# EasyEDA schematic G1000_Base.json
TITLE: Sheet_1; REV: 1.0; Date: 2024-03-30; Sheet: 1/1; Drawn By: gagagu1; Company: Your Company
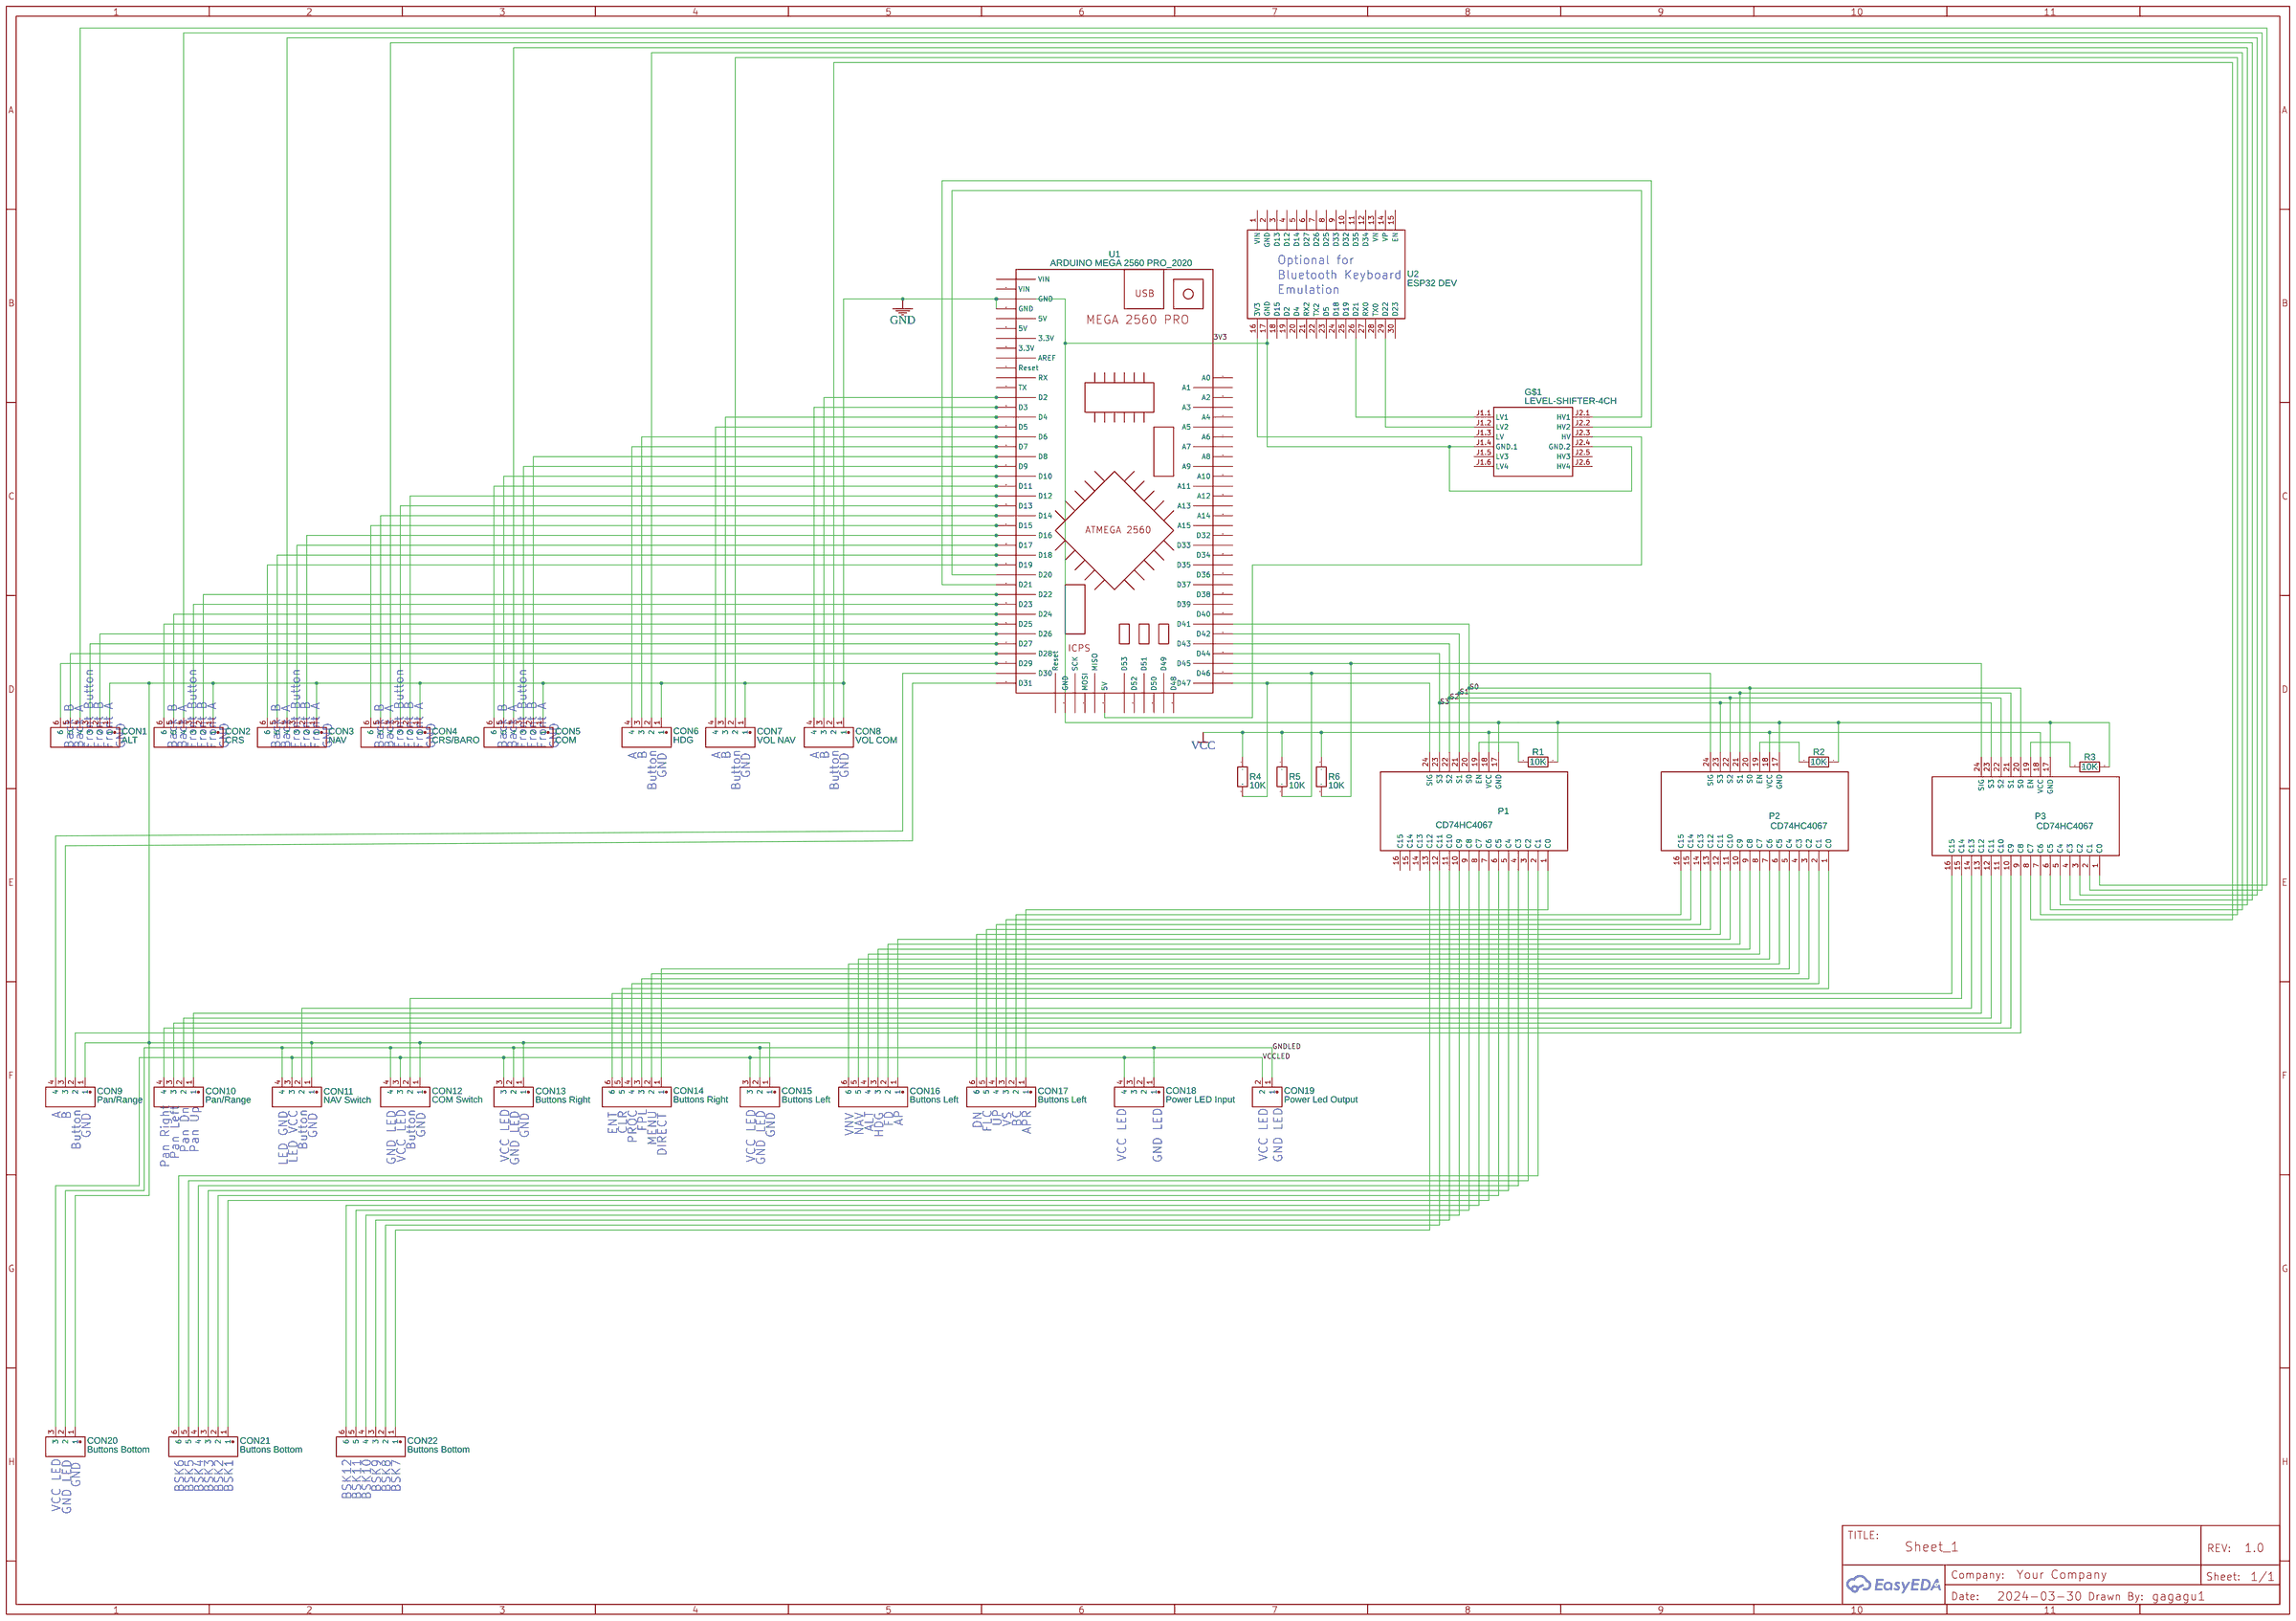
[diagram p0: schematic sheet]

## Parts
CON1  ALT  [ARUN-CONN-TH_XH-6A]
CON2  CRS  [ARUN-CONN-TH_XH-6A]
CON3  NAV  [ARUN-CONN-TH_XH-6A]
CON4  CRS/BARO  [ARUN-CONN-TH_XH-6A]
CON5  COM  [ARUN-CONN-TH_XH-6A]
CON6  HDG  [ARUN-CONN-TH_XH-4A-1]
CON7  VOL NAV  [ARUN-CONN-TH_XH-4A-1]
CON8  VOL COM  [ARUN-CONN-TH_XH-4A-1]
CON9  Pan/Range  [ARUN-CONN-TH_XH-4A-1]
CON10  Pan/Range  [ARUN-CONN-TH_XH-4A-1]
CON11  NAV Switch  [1X4 PIN]
CON12  COM Switch  [1X4 PIN]
CON13  Buttons Right  [CONN-TH_3P-P2.50_HC-XH-3A-G]
CON14  Buttons Right  [ARUN-CONN-TH_XH-6A]
CON15  Buttons Left  [CONN-TH_3P-P2.50_HC-XH-3A-G]
CON16  Buttons Left  [ARUN-CONN-TH_XH-6A]
CON17  Buttons Left  [ARUN-CONN-TH_XH-6A]
CON18  Power LED Input  [ARUN-CONN-TH_XH-4A-1]
CON19  Power Led Output  [CONN-TH_2P-P2.50_HC-XH-2A-G]
CON20  Buttons Bottom  [CONN-TH_3P-P2.50_HC-XH-3A-G]
CON21  Buttons Bottom  [ARUN-CONN-TH_XH-6A]
CON22  Buttons Bottom  [ARUN-CONN-TH_XH-6A]
G$1  LEVEL-SHIFTER-4CH  [LEVEL-SHIFTER-4CH]
P1  CD74HC4067  [CD74HC4067]
P2  CD74HC4067  [CD74HC4067]
P3  CD74HC4067  [CD74HC4067]
R1  10K  [R_AXIAL-0.4]
R2  10K  [R_AXIAL-0.4]
R3  10K  [R_AXIAL-0.4]
R4  10K  [R_AXIAL-0.4]
R5  10K  [R_AXIAL-0.4]
R6  10K  [R_AXIAL-0.4]
U1  ARDUINO MEGA 2560 PRO_2020  [ARDUINO MEGA 2560 PRO]
U2  ESP32 DEV  [ESP32_DEVKIT_MELIFE]

## Library data of the parts
CON1-CON5 CON14 CON16 CON17 CON21 CON22 = ARUN-CONN-TH_XH-6A: Supplier: LCSC; Supplier Part: C722879; Manufacturer: CAX; Manufacturer Part: XH-6A; Contributor: LCSC; JLCPCB Part Class: Extended Part
CON6-CON10 CON18 = ARUN-CONN-TH_XH-4A: Supplier: LCSC; Supplier Part: C192885; Manufacturer: BOOMELE(博穆精密); Manufacturer Part: XH-4A绿色; JLCPCB Part Class: Extended Part; Contributor: LCSC
CON11 CON12 = 1X4PIN: Supplier: LCSC; Supplier Part: C225501; Manufacturer: Changjiang Connectors; Manufacturer Part: A2541HWV-4P; Contributor: LCSC; JLCPCB Part Class: Extended Part
CON13 CON15 CON20 = HC-XH-3A-G: Contributor: Мэтт Милер; Supplier: LCSC; Supplier Part: C5341202; Manufacturer: HCTL(华灿天禄); JLCPCB Part Class: Extended Part
CON19 = HC-XH-2A-G: Supplier: LCSC; Supplier Part: C5341201; Manufacturer: HCTL(华灿天禄); link: https://atta.szlcsc.com/upload/public/pdf/source/20230105/4FFD2EFD3DA44AA828171A44400F3EDE.pdf; Contributor: zafariqbal832159; JLCPCB Part Class: Extended Part
G$1 = LEVEL-SHIFTER-4CH: Contributor: Ex T
P1-P3 = CD74HC4067: sourceId: 1T5FDZYC8; Contributor: andy vu
R1-R6 = R_AXIAL-0.4_EU: Contributor: LCEDA_Lib
U1 = ARDUINO MEGA 2560 PRO_2020: Manufacturer Part: Arduino Mega 2560 Pro Mini; link: https://www.arduino.cc; Contributor: sinivan003
U2 = ESP32 DEV: Manufacturer Part: ESP32; link: https://www.amazon.com/gp/product/B07Q576VWZ/ref=ppx_yo_dt_b_search_asin_title?ie=UTF8&psc=1; Contributor: Alan

## Nets
GND: CON1.1 CON2.1 CON3.1 CON4.1 CON5.1 CON6.1 CON7.1 CON8.1 CON9.1 CON11.1 CON12.1 CON13.1 CON15.1 CON20.1 G$1.J1.4(GND.1) G$1.J2.4(GND.2) P1.17(GND) P2.17(GND) P3.17(GND) R1.1 R2.1 R3.1 U1.43(GND) U1.83(GND) U1.84(GND) U2.17(GND)
GNDLED: CON11.4 CON12.4 CON13.2 CON15.2 CON18.1 CON19.1 CON20.2
VCC: P1.18(VCC) P2.18(VCC) P3.18(VCC) R4.1 R5.1 R6.1
VCCLED: CON11.3 CON12.3 CON13.3 CON15.3 CON18.4 CON19.2 CON20.3
S0: P1.20(S0) P2.20(S0) P3.20(S0) U1.26(D41)
S1: P1.21(S1) P2.21(S1) P3.21(S1) U1.27(D42)
S2: P1.22(S2) P2.22(S2) P3.22(S2) U1.28(D43)
S3: P1.23(S3) P2.23(S3) P3.23(S3) U1.29(D44)
Net-(CON1-2): CON1.2 U1.50(D26)
Net-(CON1-3): CON1.3 U1.49(D27)
Net-(CON1-4): CON1.4 P3.1(C0)
Net-(CON1-5): CON1.5 U1.48(D28)
Net-(CON1-6): CON1.6 U1.47(D29)
Net-(CON2-2): CON2.2 U1.54(D22)
Net-(CON2-3): CON2.3 U1.53(D23)
Net-(CON2-4): CON2.4 P3.2(C1)
Net-(CON2-5): CON2.5 U1.52(D24)
Net-(CON2-6): CON2.6 U1.51(D25)
Net-(CON3-2): CON3.2 U1.60(D16)
Net-(CON3-3): CON3.3 U1.59(D17)
Net-(CON3-4): CON3.4 P3.3(C2)
Net-(CON3-5): CON3.5 U1.58(D18)
Net-(CON3-6): CON3.6 U1.57(D19)
Net-(CON4-2): CON4.2 U1.64(D12)
Net-(CON4-3): CON4.3 U1.63(D13)
Net-(CON4-4): CON4.4 P3.4(C3)
Net-(CON4-5): CON4.5 U1.62(D14)
Net-(CON4-6): CON4.6 U1.61(D15)
Net-(CON5-2): CON5.2 U1.68(D8)
Net-(CON5-3): CON5.3 U1.67(D9)
Net-(CON5-4): CON5.4 P3.5(C4)
Net-(CON5-5): CON5.5 U1.66(D10)
Net-(CON5-6): CON5.6 U1.65(D11)
Net-(CON6-2): CON6.2 P3.6(C5)
Net-(CON6-3): CON6.3 U1.70(D6)
Net-(CON6-4): CON6.4 U1.69(D7)
Net-(CON7-2): CON7.2 P3.7(C6)
Net-(CON7-3): CON7.3 U1.72(D4)
Net-(CON7-4): CON7.4 U1.71(D5)
Net-(CON8-2): CON8.2 P3.8(C7)
Net-(CON8-3): CON8.3 U1.74(D2)
Net-(CON8-4): CON8.4 U1.73(D3)
Net-(CON9-2): CON9.2 P3.9(C8)
Net-(CON9-3): CON9.3 U1.45(D31)
Net-(CON9-4): CON9.4 U1.46(D30)
Net-(CON10-1): CON10.1 P3.13(C12)
Net-(CON10-2): CON10.2 P3.12(C11)
Net-(CON10-3): CON10.3 P3.11(C10)
Net-(CON10-4): CON10.4 P3.10(C9)
Net-(CON11-2): CON11.2 P3.14(C13)
Net-(CON12-2): CON12.2 P3.15(C14)
Net-(CON14-1): CON14.1 P2.5(C4)
Net-(CON14-2): CON14.2 P2.4(C3)
Net-(CON14-3): CON14.3 P2.3(C2)
Net-(CON14-4): CON14.4 P2.2(C1)
Net-(CON14-5): CON14.5 P2.1(C0)
Net-(CON14-6): CON14.6 P3.16(C15)
Net-(CON16-1): CON16.1 P2.11(C10)
Net-(CON16-2): CON16.2 P2.10(C9)
Net-(CON16-3): CON16.3 P2.9(C8)
Net-(CON16-4): CON16.4 P2.8(C7)
Net-(CON16-5): CON16.5 P2.7(C6)
Net-(CON16-6): CON16.6 P2.6(C5)
Net-(CON17-1): CON17.1 P1.1(C0)
Net-(CON17-2): CON17.2 P2.16(C15)
Net-(CON17-3): CON17.3 P2.15(C14)
Net-(CON17-4): CON17.4 P2.14(C13)
Net-(CON17-5): CON17.5 P2.13(C12)
Net-(CON17-6): CON17.6 P2.12(C11)
Net-(CON21-1): CON21.1 P1.7(C6)
Net-(CON21-2): CON21.2 P1.6(C5)
Net-(CON21-3): CON21.3 P1.5(C4)
Net-(CON21-4): CON21.4 P1.4(C3)
Net-(CON21-5): CON21.5 P1.3(C2)
Net-(CON21-6): CON21.6 P1.2(C1)
Net-(CON22-1): CON22.1 P1.13(C12)
Net-(CON22-2): CON22.2 P1.12(C11)
Net-(CON22-3): CON22.3 P1.11(C10)
Net-(CON22-4): CON22.4 P1.10(C9)
Net-(CON22-5): CON22.5 P1.9(C8)
Net-(CON22-6): CON22.6 P1.8(C7)
Net-(G$1-J1.1): G$1.J1.1(LV1) U2.26(D21)
Net-(G$1-J1.2): G$1.J1.2(LV2) U2.29(D22)
Net-(G$1-J1.3): G$1.J1.3(LV) U2.16(3V3)
Net-(G$1-J2.1): G$1.J2.1(HV1) U1.56(D20)
Net-(G$1-J2.2): G$1.J2.2(HV2) U1.55(D21)
Net-(G$1-J2.3): G$1.J2.3(HV) U1.39(5V)
Net-(P1-19): P1.19(EN) R1.2
Net-(P1-24): P1.24(SIG) R4.2 U1.32(D47)
Net-(P2-19): P2.19(EN) R2.2
Net-(P2-24): P2.24(SIG) R5.2 U1.31(D46)
Net-(P3-19): P3.19(EN) R3.2
Net-(P3-24): P3.24(SIG) R6.2 U1.30(D45)

Not connected (* = marked no-connect by the designer): CON18 2 3; G$1 J1.5(LV3) J1.6(LV4) J2.5(HV3) J2.6(HV4); P1 14(C13) 15(C14) 16(C15); U1 1(A0) 2(A1) 3(A2) 4(A3) 5(A4) 6(A5) 7(A6) 8(A7) 9(A8) 10(A9) 11(A10) 12(A11) 13(A12) 14(A13) 15(A14) 16(A15) 17(D32) 18(D33) 19(D34) 20(D35) 21(D36) 22(D37) 23(D38) 24(D39) 25(D40) 33(D48) 34(D49) 35(D50) 36(D51) 37(D52) 38(D53) 40(MISO) 41(MOSI) 42(SCK) 44(Reset) 75(TX) 76(RX) 77(Reset) 78(AREF) 79(3.3V) 80(3.3V) 81(5V) 82(5V) 85(VIN) 86(VIN); U2 1(VIN) 2(GND) 3(D13) 4(D12) 5(D14) 6(D27) 7(D26) 8(D25) 9(D33) 10(D32) 11(D35) 12(D34) 13(VN) 14(VP) 15(EN) 18(D15) 19(D2) 20(D4) 21(RX2) 22(TX2) 23(D5) 24(D18) 25(D19) 27(RX0) 28(TX0) 30(D23)

## Notes on the sheet
- Optional for
- Bluetooth Keyboard
- Emulation
- Back B
- Back A
- Front Button
- Front B
- Front A
- GND
- Back B
- Back A
- Front Button
- Front B
- Front A
- GND
- Back B
- Back A
- Front Button
- Front B
- Front A
- GND
- Back B
- Back A
- Front Button
- Front B
- Front A
- GND
- Back B
- Back A
- Front Button
- Front B
- Front A
- GND
- A
- B
- A
- B
- A
- B
- GND
- GND
- GND
- Button
- Button
- Button
- A
- B
- ENT
- CLR
- FPL
- VNV
- NAV
- ALT
- FD
- AP
- DN
- FLC
- UP
- VS
- BC
- APR
- GND
- GND
- GND
- GND
- PROC
- MENU
- GND
- HDG
- Button
- Pan Left
- Pan Dn
- Pan Up
- Button
- Button
- DIRECT
- Pan Right
- LED GND
- LED VCC
- GND LED
- VCC LED
- VCC LED
- GND LED
- VCC LED
- GND LED
- VCC LED
- GND LED
- VCC LED
- GND LED
- GND
- BSK6
- BSK5
- BSK4
- BSK3
- BSK2
- BSK1
- BSK9
- BSK8
- BSK7
- BSK12
- BSK11
- BSK10
- VCC LED
- GND LED
